# EAGLE design usb tester (EAGLE 7.6.0)
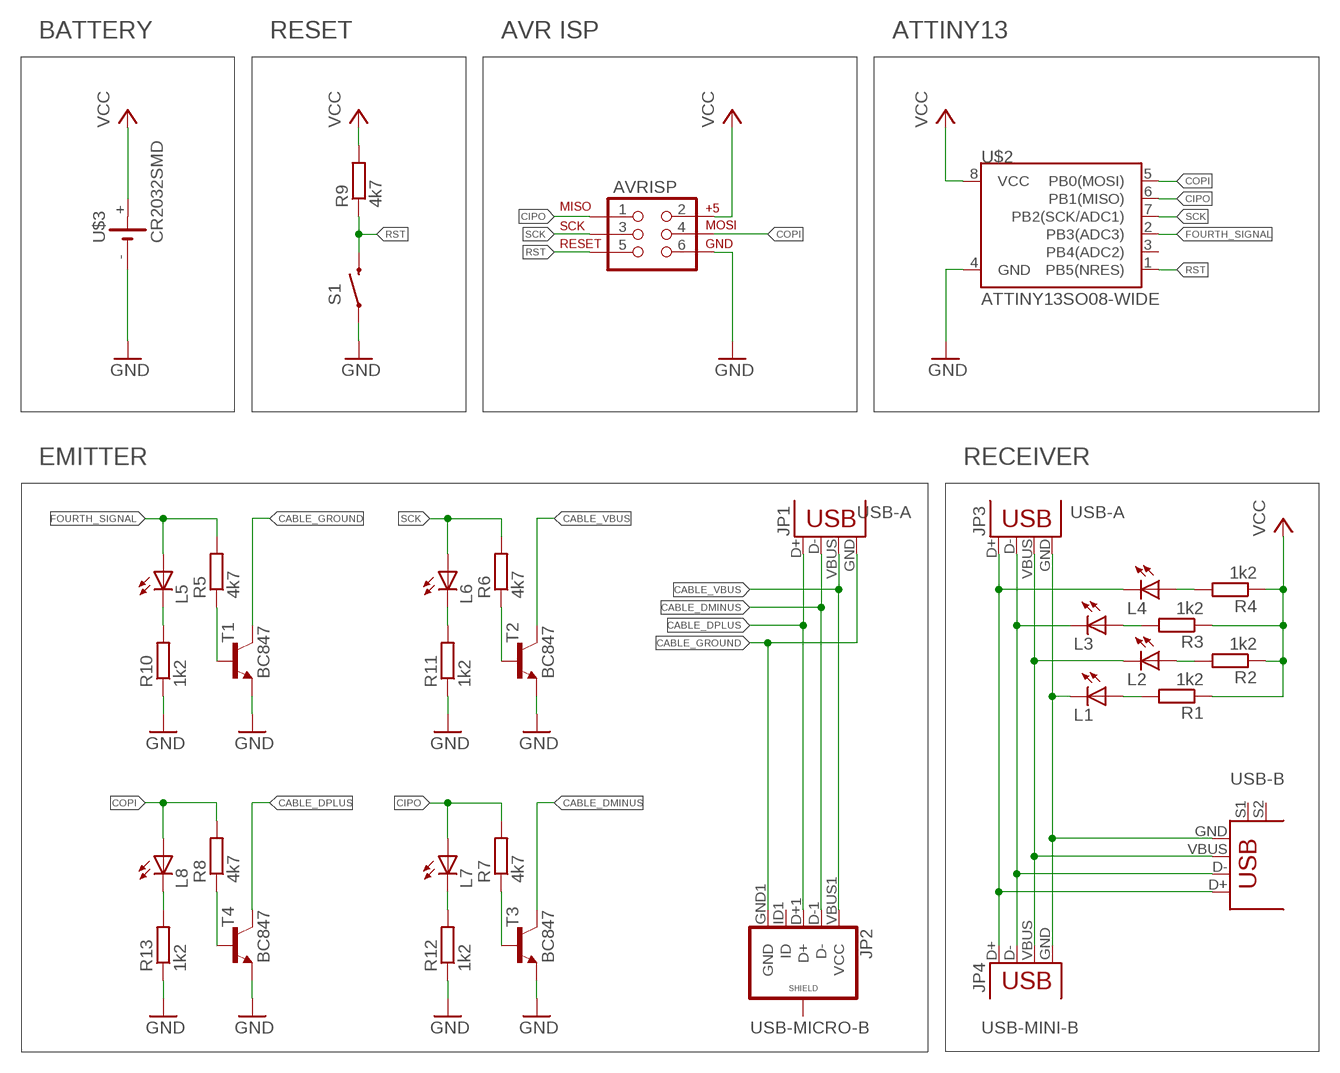
[diagram p0: schematic, sheet 1]

## Parts
AVRISP  AVR_SPI_PRG_62X3_LOCK  [2X3_LOCK]
JP1  USB-A-SMD  [USB-A-S-NOSILK-FEMALE]
JP2  USB_MICROB_PLUG-IDK  [USB-AB-MICRO-SMD_SLOT]
JP3  USB-A-SMD  [USB-A-S-NOSILK-FEMALE]
JP4  USB-SMD-NS  [USB-MINIB-NOSTOP]
L1  LEDCHIPLED_0805  [CHIPLED_0805]
L2  LEDCHIPLED_0805  [CHIPLED_0805]
L3  LEDCHIPLED_0805  [CHIPLED_0805]
L4  LEDCHIPLED_0805  [CHIPLED_0805]
L5  LEDCHIPLED_0805  [CHIPLED_0805]
L6  LEDCHIPLED_0805  [CHIPLED_0805]
L7  LEDCHIPLED_0805  [CHIPLED_0805]
L8  LEDCHIPLED_0805  [CHIPLED_0805]
R1  1k2  R-EU_R0603  [R0603]
R2  1k2  R-EU_R0603  [R0603]
R3  1k2  R-EU_R0603  [R0603]
R4  1k2  R-EU_R0603  [R0603]
R5  4k7  R-EU_R0603  [R0603]
R6  4k7  R-EU_R0603  [R0603]
R7  4k7  R-EU_R0603  [R0603]
R8  4k7  R-EU_R0603  [R0603]
R9  4k7  R-EU_R0603  [R0603]
R10  1k2  R-EU_R0603  [R0603]
R11  1k2  R-EU_R0603  [R0603]
R12  1k2  R-EU_R0603  [R0603]
R13  1k2  R-EU_R0603  [R0603]
S1  SWITCH-MOMENTARY-2SMD-4  [TACTILE_SWITCH_TALL]
T1  BC847  [SOT23]
T2  BC847  [SOT23]
T3  BC847  [SOT23]
T4  BC847  [SOT23]
U$1  USB+SHIELD  [USB-B-PTH]
U$2  ATTINY13SO08-WIDE  [SO08-EIAJ]
U$3  CR2032SMD  [CR2032SMD]

## Nets
CABLE_DMINUS: JP1.D- JP2.D-1(D-) T3.3(C)
CABLE_DPLUS: JP1.D+ JP2.D+1(D+) T4.3(C)
CABLE_GROUND: JP1.GND JP2.GND1(GND) T1.3(C)
CABLE_VBUS: JP1.VBUS JP2.VBUS1(VCC) T2.3(C)
CIPO: AVRISP.1 L7.A R7.2 U$2.6(PB1(MISO))
COPI: AVRISP.4 L8.A R8.2 U$2.5(PB0(MOSI))
FOURTH_SIGNAL: L5.A R5.2 U$2.2(PB3(ADC3))
GND: AVRISP.6 R10.1 R11.1 R12.1 R13.1 S1.A2 T1.2(E) T2.2(E) T3.2(E) T4.2(E) U$2.4(GND) U$3.-
N$1: L2.A R2.2
N$2: L4.A R4.2
N$3: L3.A R3.2
N$5: R5.1 T1.1(B)
N$6: L1.A R1.2
N$7: R7.1 T3.1(B)
N$9: R8.1 T4.1(B)
N$25: L8.C R13.2
N$30: L5.C R10.2
N$31: L6.C R11.2
N$32: L7.C R12.2
N$33: R6.1 T2.1(B)
OTHER_DMINUS: JP3.D- JP4.D- L3.C U$1.D-
OTHER_DPLUS: JP3.D+ JP4.D+ L4.C U$1.D+
OTHER_GROUND: JP3.GND JP4.GND L1.C U$1.GND
OTHER_VBUS: JP3.VBUS JP4.VBUS L2.C U$1.VBUS
RST: AVRISP.5 R9.1 S1.B2 U$2.1(PB5(NRES))
SCK: AVRISP.3 L6.A R6.2 U$2.7(PB2(SCK/ADC1))
VCC: AVRISP.2 R1.1 R2.1 R3.1 R4.1 R9.2 U$2.8(VCC) U$3.+
Unconnected: JP2.ID1(ID) JP2.P$1(SHIELD) JP2.P$2(SHIELD) JP2.P$3(SHIELD) JP2.P$4(SHIELD) U$1.S1 U$1.S2 U$2.3(PB4(ADC2))

## Notes on the sheet
- BATTERY | RESET | AVR ISP | ATTINY13
- EMITTER | RECEIVER
- USB-A | USB-A
- USB-B
- USB-MICRO-B | USB-MINI-B

## Library data of the parts
AVRISP = SparkFun-Connectors:AVR_SPI_PRG_6: AVR ISP 6 Pin This is the reduced ISP connector for AVR programming. Common on Arduino. This footprint will take up less PCB space and can be used with a 10-pin to 6-pin adapter such as SKU: BOB-08508 **Special note about "TEST_POINT" package. The stop mask is on the top side, so if you want your programming test points to be on the bottom of your board, make sure to place this package on the bottom side of the board. This also ensure that the orientation to program from the bottom side will be correct.
JP1 JP3 = SparkFun-Connectors:USB: USB Connectors USB-B-PTH is fully proven SKU : PRT-00139/CONN-08278 USB-miniB is fully proven SKU : PRT-00587 USB-A-PCB is untested. USB-A-H is throughly reviewed, but untested. Spark Fun Electronics SKU : PRT-00437 USB-B-SMT is throughly reviewed, but untested. Needs silkscreen touching up. USB-A-S has not been used/tested USB-MB-H has not been used/tested USB-MICROB has been used. CONN-09505; PROD_ID: CONN-09520
JP2 = SparkFun-Connectors:USB_MICROB_PLUG: USB Micro-B connectors Some male, some female. Watch your step!
JP4 = SparkFun-Connectors:USB: USB Connectors USB-B-PTH is fully proven SKU : PRT-00139/CONN-08278 USB-miniB is fully proven SKU : PRT-00587 USB-A-PCB is untested. USB-A-H is throughly reviewed, but untested. Spark Fun Electronics SKU : PRT-00437 USB-B-SMT is throughly reviewed, but untested. Needs silkscreen touching up. USB-A-S has not been used/tested USB-MB-H has not been used/tested USB-MICROB has been used. CONN-09505
L1-L8 = led:LED: LED OSRAM: - CHIPLED LG R971, LG N971, LY N971, LG Q971, LY Q971, LO R971, LY R971 LH N974, LH R974 LS Q976, LO Q976, LY Q976 LO Q996 - Hyper CHIPLED LW Q18S LB Q993, LB Q99A, LB R99A - SideLED LS A670, LO A670, LY A670, LG A670, LP A670 LB A673, LV A673, LT A673, LW A673 LH A674 LY A675 LS A676, LA A676, LO A676, LY A676, LW A676 LS A679, LY A679, LG A679 - Hyper Micro SIDELED® LS Y876, LA Y876, LO Y876, LY Y876 LT Y87S - SmartLED LW L88C, LW L88S LB L89C, LB L89S, LG L890 LS L89K, LO L89K, LY L89K LS L896, LA L896, LO L896, LY L896 - TOPLED LS T670, LO T670, LY T670, LG T670, LP T670 LSG T670, LSP T670, LSY T670, LOP T670, LYG T670 LG T671, LOG T671, LSG T671 LB T673, LV T673, LT T673, LW T673 LH T674 LS T676, LA T676, LO T676, LY T676, LB T676, LH T676, LSB T676, LW T676 LB T67C, LV T67C, LT T67C, LS T67K, LO T67K, LY T67K, LW E67C LS E67B, LA E67B, LO E67B, LY E67B, LB E67C, LV E67C, LT E67C LW T67C LS T679, LY T679, LG T679 LS T770, LO T770, LY T770, LG T770, LP T770 LB T773, LV T773, LT T773, LW T773 LH T774 LS E675, LA E675, LY E675, LS T675 LS T776, LA T776, LO T776, LY T776, LB T776 LHGB T686 LT T68C, LB T68C - Hyper Mini TOPLED® LB M676 - Mini TOPLED Santana® LG M470 LS M47K, LO M47K, LY M47K Source: http://www.osram.convergy.de LUXEON: - LUMILED® LXK2-PW12-R00, LXK2-PW12-S00, LXK2-PW14-U00, LXK2-PW14-V00 LXK2-PM12-R00, LXK2-PM12-S00, LXK2-PM14-U00 LXK2-PE12-Q00, LXK2-PE12-R00, LXK2-PE12-S00, LXK2-PE14-T00, LXK2-PE14-U00 LXK2-PB12-K00, LXK2-PB12-L00, LXK2-PB12-M00, LXK2-PB14-N00, LXK2-PB14-P00, LXK2-PB14-Q00 LXK2-PR12-L00, LXK2-PR12-M00, LXK2-PR14-Q00, LXK2-PR14-R00 LXK2-PD12-Q00, LXK2-PD12-R00, LXK2-PD12-S00 LXK2-PH12-R00, LXK2-PH12-S00 LXK2-PL12-P00, LXK2-PL12-Q00, LXK2-PL12-R00 Source: www.luxeon.com KINGBRIGHT: KA-3528ASYC Source: www.kingbright.com
R1-R13 = rcl:R-EU_: RESISTOR, European symbol
S1 = SparkFun-Electromechanical:SWITCH-MOMENTARY-2: Various NO switches- pushbuttons, reed, etc; PROD_ID: SWCH-11966
T1-T4 = transistor:BC847: NPN TRANSISTOR
U$1 = SparkFun-Connectors Kopie:USB+SHIELD: USB+Shield USB connector with shield pins connectable
U$2 = SparkFun-DigitalIC:ATTINY13: Atmel 8-pin 1kB flash uC
U$3 = battery:CR2032SMD

## Board
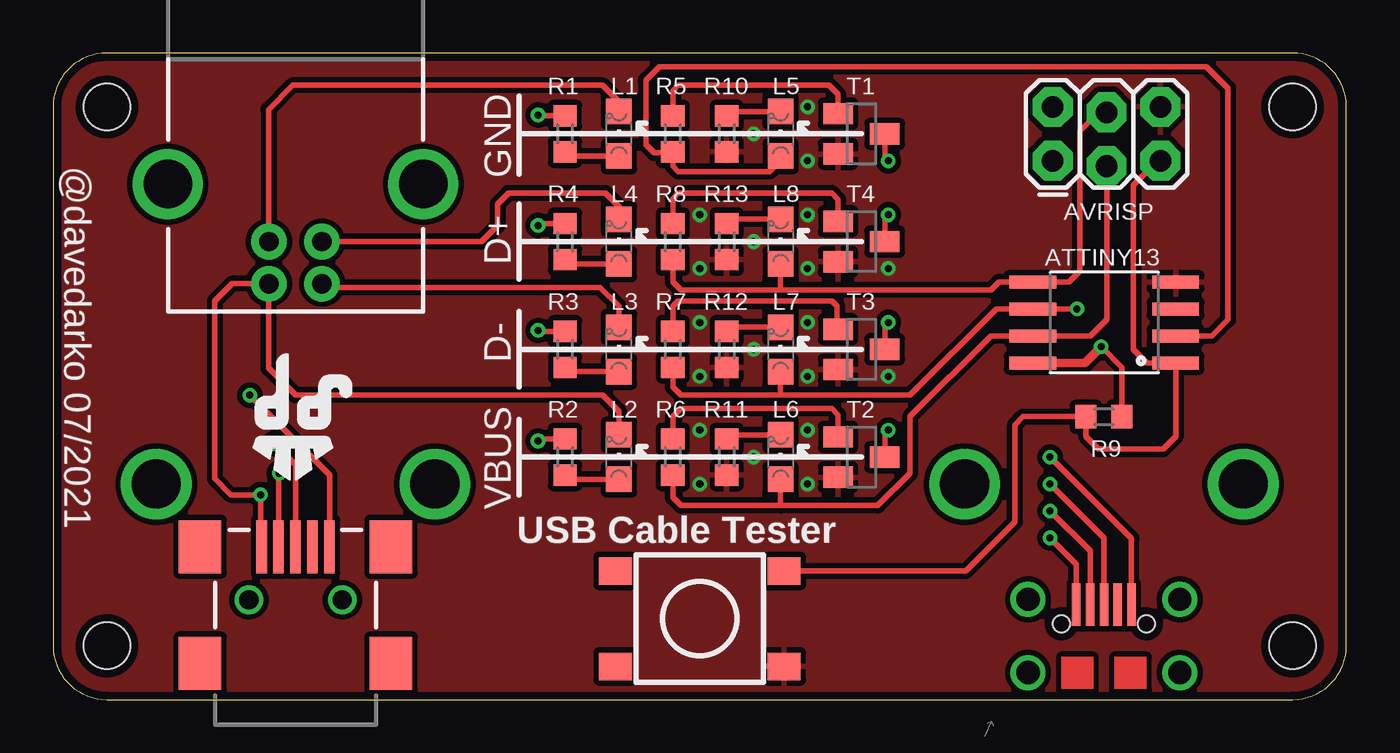
[diagram p1: board, top side]
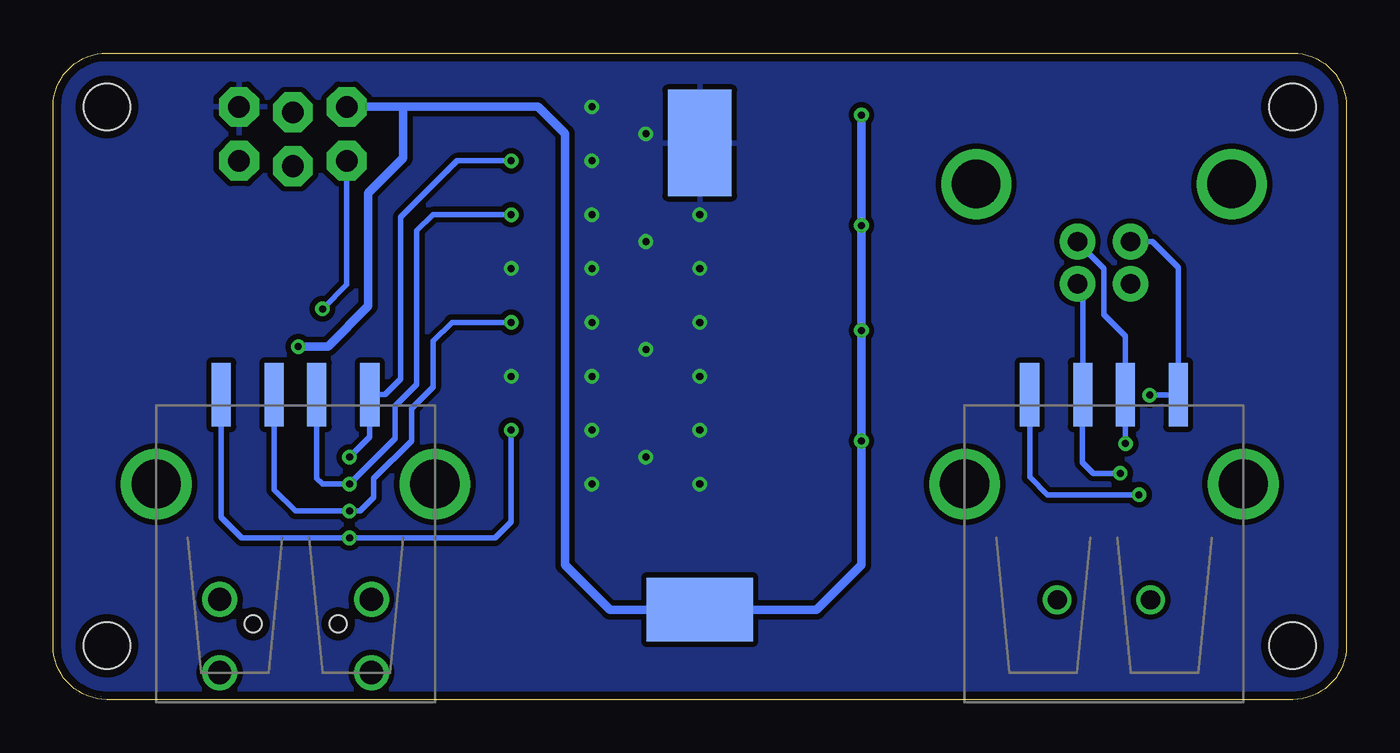
[diagram p2: board, bottom side, seen from below]

Size 60.96 x 30.48 mm. Coordinates in mm from the lower left corner, seen from the top.
Outline: 60.96,2.54 60.96,27.94 arc90 58.42,30.48 2.54,30.48 arc90 0,27.94 0,2.54 arc90 2.54,0 58.42,0 arc90 60.96,2.54
Copper layers (1*16): Top 0.0356mm / dielectric 1.5011mm / Bottom 0.0356mm
Design rules "LaenPCBOrder *": minimum track width 6mil, minimum drill 13mil, track to track 6mil, track to pad 6mil, pad to pad 6mil, via to via 6mil, smd to smd 6mil, copper to edge 15mil, drill to drill 6mil, minimum pad ring 7mil, minimum via ring 7mil, stop-mask expansion 3mil, vias tented up to drill 2000mil, thermal gap 10mil
Holes 2.2 mm at 58.42,2.54 58.42,27.94 2.54,2.54 2.54,27.94

### Footprints (pad centres in the part's own frame; a part is rotated, then mirrored left to right if it is on the bottom)
2X3_LOCK = drill 1.016 pad 1.88 octagon: 1 0,0; 2 0,2.54; 3 2.54,-0.254; 4 2.54,2.286; 5 5.08,0; 6 5.08,2.54
USB-A-S-NOSILK-FEMALE = smd 3 x 0.9: D+ 4.212,-1; D- 4.212,1; GND 4.212,-3.5; VBUS 4.212,3.5 | drill 2.311: S1 0,-6.566; S2 0,6.566
USB-AB-MICRO-SMD_SLOT = smd 2 x 0.4: D+1 3.2,0; D-1 3.2,0.65; GND1 3.2,-1.3; ID1 3.2,-0.65; VBUS1 3.2,1.3 | drill 1.1: P$1 0,3.575; P$2 0,-3.575; P$3 3.45,-3.575; P$4 3.45,3.575 | hole 0.8: 2.3,2; 2.3,-2
USB-MINIB-NOSTOP = smd 2.5 x 0.5: D+ 2.5,0; D- 2.5,0.8; GND 2.5,-1.6; ID 2.5,-0.8; VBUS 2.5,1.6 | smd 2.5 x 2: G1 -3,-4.5; G2 -3,4.5; G3 2.5,4.5; G4 2.5,-4.5 | drill 0.9 pad 0.8: H1 0,2.2 | drill 0.9 pad 0.787: H2 0,-2.2
CHIPLED_0805 = smd 1.2 x 1.2: A 0,-1.05; C 0,1.05
R0603 = smd 1 x 1.1: 1 -0.85,0; 2 0.85,0
TACTILE_SWITCH_TALL = smd 1.55 x 1.3: A1 -3.975,-2.25; A2 3.975,-2.25; B1 -3.975,2.25; B2 3.975,2.25
SOT23 = smd 1 x 1.4: 1 -0.95,-1.1; 2 0.95,-1.1; 3 0,1.1
USB-B-PTH = drill 0.914 pad 1.676: D+ 0,1.25; D- 1.981,1.25; GND 0,-1.25; VBUS 1.981,-1.25 | drill 2.286: S1 -2.718,-6.02; S2 -2.718,6.02
SO08-EIAJ = smd 0.61 x 2.21: 1 -1.905,-3.378; 2 -0.635,-3.378; 3 0.635,-3.378; 4 1.905,-3.378; 5 1.905,3.353; 6 0.635,3.353; 7 -0.635,3.353; 8 -1.905,3.353
CR2032SMD = smd 5 x 3: + 0,-11 | smd 3 x 5: - 0,11

### Placement (x,y rotation side)
AVRISP  47.12,25.4 0 top
JP1  49.53,10.16 90 bottom
JP2  49.53,1.27 90 top
JP3  11.43,10.16 90 bottom
JP4  11.43,4.7 90 top
L1  26.67,26.67 0 top
L2  26.67,11.43 0 top
L3  26.67,16.51 0 top
L4  26.67,21.59 0 top
L5  34.29,26.67 0 top
L6  34.29,11.43 0 top
L7  34.29,16.51 0 top
L8  34.29,21.59 0 top
R1  24.13,26.67 270 top
R2  24.13,11.43 270 top
R3  24.13,16.51 270 top
R4  24.13,21.59 270 top
R5  29.21,26.67 270 top
R6  29.21,11.43 270 top
R7  29.21,16.51 270 top
R8  29.21,21.59 270 top
R9  49.53,13.34 0 top
R10  31.75,26.67 90 top
R11  31.75,11.43 90 top
R12  31.75,16.51 90 top
R13  31.75,21.59 90 top
S1  30.48,3.81 0 top
T1  38.1,26.67 270 top
T2  38.1,11.43 270 top
T3  38.1,16.51 270 top
T4  38.1,21.59 270 top
U$1  11.43,21.59 270 top
U$2  49.53,17.78 90 top
U$3  30.48,15.24 0 bottom
U$4  [DAVEDARKO2_LOGO]  11.3,12.57 0 top

### Tracks (layer width: path | path; a pad name or v marks a point on that pad's centre or on a via)
CABLE_DMINUS  (via drill 0.33)
  Top 0.254: JP2.D-1 48.88,7 v46.99,8.89 | T3.3 39.2,17.61 v39.37,17.78
  Bottom 0.254: JP1.D- 50.53,9.89 49.53,8.89 v46.99,8.89 46.48,8.89 45.85,9.53 45.85,10.41 44.07,12.19 44.07,13.72 43.05,14.73 43.05,16.89 42.16,17.78 v39.37,17.78
CABLE_DPLUS  (via drill 0.33)
  Top 0.254: JP2.D+1 49.53,7.62 v46.99,10.16 | T4.3 39.2,22.69 v39.37,22.86
  Bottom 0.254: JP1.D+ 48.53,10.43 48.26,10.16 v46.99,10.16 44.83,12.32 44.83,13.84 43.81,14.86 43.81,22.1 43.05,22.86 v39.37,22.86
CABLE_GROUND  (via drill 0.33)
  Top 0.254: JP2.GND1 50.83,7.59 v46.99,11.43 | T1.3 39.2,25.61 v39.37,25.4
  Bottom 0.254: v46.99,11.43 46.03,12.39 JP1.GND 45.32,14.37 44.58,15.11 44.58,22.73 41.91,25.4 v39.37,25.4
CABLE_VBUS  (via drill 0.33)
  Top 0.254: JP2.VBUS1 48.23,6.38 v46.99,7.62 | T2.3 39.2,12.53 v39.37,12.7
  Bottom 0.254: JP1.VBUS 53.03,8.58 52.07,7.62 v46.99,7.62 40.13,7.62 39.37,8.38 v39.37,12.7
CIPO  (via drill 0.33)
  Top 0.254: L7.A 34.29,14.35 | 34.29,14.35 29.59,14.35 29.21,14.73 R7.2 | v48.26,18.41 U$2.6 44.45,18.41 40.39,14.35 34.29,14.35
  Bottom 0.254: AVRISP.1 47.12,19.56 v48.26,18.41
COPI
  Top 0.254: L8.A 34.29,19.3 | 34.29,19.3 29.59,19.3 29.21,19.68 R8.2 | AVRISP.4 49.28,27.69 48.39,26.8 48.39,20.19 47.88,19.68 U$2.5 44.58,19.68 44.2,19.3 34.29,19.3
FOURTH_SIGNAL
  Top 0.254: L5.A 34.29,25.4 33.78,24.89 29.46,24.89 29.21,25.15 R5.2 29.17,25.78 28.32,25.78 27.94,26.16 27.94,29.21 28.57,29.84 54.36,29.84 55.37,28.83 55.37,17.91 54.61,17.14 U$2.2
GND  (via drill 0.33)
  other vias: 35.56,10.16 35.56,12.7 30.48,12.7 30.48,10.16 30.48,15.24 30.48,17.78 35.56,17.78 35.56,15.24 35.56,20.32 35.56,22.86 35.56,25.4 35.56,27.94 33.02,26.67 30.48,20.32 30.48,22.86 33.02,21.59 33.02,16.51 33.02,11.43 39.37,15.24 39.37,20.32
  pour Top (isolate 0.254): 60.96,-1.27 0,-1.27 0,33.02 60.96,33.02
  pour Bottom (isolate 0.254): 62.23,-2.54 -1.27,-2.54 -1.27,30.48 62.23,31.75
N$1
  Top 0.254: L2.A 24.33,10.38 R2.2
N$2
  Top 0.254: L4.A 24.33,20.54 R4.2
N$3
  Top 0.254: L3.A 24.33,15.46 R3.2
N$5
  Top 0.254: T1.1 37,28.53 36.58,28.96 29.46,28.96 29.21,28.7 R5.1
N$6
  Top 0.254: L1.A 24.33,25.62 R1.2
N$7
  Top 0.254: R7.1 29.21,18.54 29.46,18.8 36.7,18.8 36.96,18.54 36.96,17.5 T3.1
N$9
  Top 0.254: T4.1 37,23.58 36.7,23.88 29.46,23.88 29.21,23.62 R8.1
N$25
  Top 0.254: L8.C 31.95,22.64 R13.2
N$30
  Top 0.254: L5.C 31.95,27.72 R10.2
N$31
  Top 0.254: L6.C 31.95,12.48 R11.2
N$32
  Top 0.254: L7.C 31.95,17.56 R12.2
N$33
  Top 0.254: T2.1 37,13.42 36.7,13.72 29.59,13.72 29.21,13.34 R6.1
OTHER_DMINUS  (via drill 0.33)
  Top 0.254: JP4.D- 10.63,10.63 v10.67,10.67 | L3.C 26.67,18.54 25.78,19.43 12.86,19.43 U$1.D-
  Bottom 0.254: U$1.D- 12.43,19.36 JP3.D- 12.45,14.36 12.45,11.18 11.94,10.67 v10.67,10.67
OTHER_DPLUS  (via drill 0.33)
  Top 0.254: JP4.D+ 11.43,11.05 v10.41,12.06 | L4.C 26.67,23.24 26.04,23.88 21.46,23.88 20.95,23.37 20.95,22.35 20.19,21.59 U$1.D+
  Bottom 0.254: U$1.D+ 12.68,21.57 11.43,20.32 11.43,18.16 10.41,17.14 10.41,14.39 | v10.41,12.06 10.41,14.39 | 10.41,14.39 JP3.D+
OTHER_GROUND  (via drill 0.33)
  Top 0.254: JP4.GND 13.03,10.59 v9.27,14.35 | L1.C 26.67,28.19 25.91,28.96 11.3,28.96 10.16,27.81 10.16,21.61 U$1.GND
  Bottom 0.254: U$1.GND 9.14,21.59 7.93,20.38 JP3.GND 7.95,14.35 v9.27,14.35
OTHER_VBUS  (via drill 0.33)
  Top 0.254: JP4.VBUS 9.78,7.38 v9.78,9.65 8.38,9.65 7.62,10.41 7.62,18.8 8.43,19.61 U$1.VBUS 10.16,19.59 10.16,15.62 11.43,14.35 25.91,14.35 26.67,13.59 L2.C
  Bottom 0.254: JP3.VBUS 14.93,10.48 14.1,9.65 v9.78,9.65
RST
  Top 0.254: AVRISP.5 52.07,25.4 50.93,24.26 50.93,16.51 51.56,15.88 U$2.1 52.91,12.39 52.32,11.81 49.28,11.81 48.68,12.41 R9.1 45.72,13.34 45.34,12.95 45.34,8.38 43.02,6.06 S1.B2
SCK
  Top 0.254: L6.A 34.29,9.14 | 34.29,9.14 29.59,9.14 29.21,9.53 R6.2 | AVRISP.3 49.66,17.91 48.9,17.14 U$2.7 44.2,17.14 40.39,13.34 40.39,10.67 38.86,9.14 34.29,9.14
VCC  (via drill 0.33)
  Top 0.254: R1.1 22.9,27.52 v22.86,27.56 | R2.1 22.86,12.28 v22.86,12.19 | R3.1 22.86,17.36 v22.86,17.4 | R4.1 22.86,22.44 v22.86,22.35 | R9.2 50.38,15.66 v49.4,16.64
  Top 0.406: U$2.8 48.64,15.88 v49.4,16.64
  Bottom 0.406: v22.86,27.56 v22.86,22.35 v22.86,17.4 v22.86,12.19 22.86,6.35 24.97,4.24 U$3.+ 34.72,4.24 36.83,6.35 36.83,26.67 38.1,27.94 44.45,27.94 | AVRISP.2 44.45,27.94 | v49.4,16.64 48.01,16.64 46.1,18.54 46.1,23.88 44.45,25.53 44.45,27.94

### Text on the board
tNames: GND | @davedarko 07/2021 | D+ | ATTINY13 | D- | VBUS | USB Cable Tester